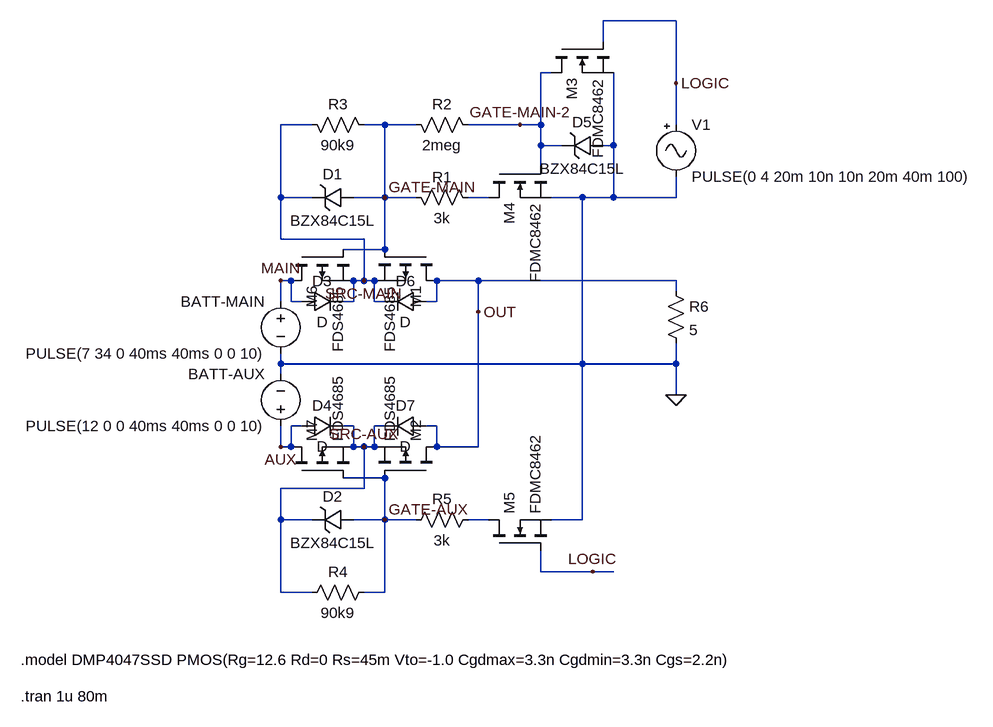
[diagram p0: schematic pmos-switch.asc]
pmos-switch.asc, the LTspice schematic file:
Version 4
SHEET 1 2144 976
WIRE 896 -80 784 -80
WIRE 784 -48 784 -80
WIRE 704 0 688 0
WIRE 896 16 896 -80
WIRE 336 80 288 80
WIRE 448 80 416 80
WIRE 496 80 448 80
WIRE 656 80 576 80
WIRE 688 80 688 0
WIRE 688 80 656 80
WIRE 896 80 896 16
WIRE 688 112 688 80
WIRE 720 112 688 112
WIRE 800 112 800 0
WIRE 800 112 784 112
WIRE 688 144 688 112
WIRE 288 192 288 80
WIRE 336 192 288 192
WIRE 448 192 448 80
WIRE 448 192 400 192
WIRE 496 192 448 192
WIRE 608 192 576 192
WIRE 752 192 704 192
WIRE 800 192 800 112
WIRE 800 192 752 192
WIRE 896 192 896 160
WIRE 896 192 800 192
WIRE 288 256 288 192
WIRE 416 256 288 256
WIRE 448 272 448 192
WIRE 448 272 384 272
WIRE 304 320 288 320
WIRE 416 320 416 256
WIRE 416 320 400 320
WIRE 432 320 416 320
WIRE 592 320 528 320
WIRE 896 320 592 320
WIRE 896 336 896 320
WIRE 288 352 288 320
WIRE 304 352 304 320
WIRE 320 352 304 352
WIRE 400 352 400 320
WIRE 400 352 384 352
WIRE 432 352 432 320
WIRE 448 352 432 352
WIRE 528 352 528 320
WIRE 528 352 512 352
WIRE 592 368 592 320
WIRE 288 448 288 432
WIRE 752 448 752 192
WIRE 752 448 288 448
WIRE 896 448 896 416
WIRE 896 448 752 448
WIRE 288 464 288 448
WIRE 896 496 896 448
WIRE 320 544 304 544
WIRE 400 544 384 544
WIRE 448 544 432 544
WIRE 528 544 512 544
WIRE 288 576 288 544
WIRE 304 576 304 544
WIRE 304 576 288 576
WIRE 400 576 400 544
WIRE 416 576 400 576
WIRE 432 576 432 544
WIRE 432 576 416 576
WIRE 528 576 528 544
WIRE 592 576 592 368
WIRE 592 576 528 576
WIRE 448 624 384 624
WIRE 416 640 416 576
WIRE 416 640 288 640
WIRE 288 688 288 640
WIRE 336 688 288 688
WIRE 448 688 448 624
WIRE 448 688 400 688
WIRE 496 688 448 688
WIRE 608 688 576 688
WIRE 752 688 752 448
WIRE 752 688 704 688
WIRE 688 768 688 736
WIRE 768 768 688 768
WIRE 800 768 768 768
WIRE 288 800 288 688
WIRE 336 800 288 800
WIRE 448 800 448 688
WIRE 448 800 416 800
FLAG 896 496 0
FLAG 448 192 GATE-MAIN
FLAG 592 368 OUT
FLAG 448 688 GATE-AUX
FLAG 288 320 MAIN
FLAG 288 576 AUX
FLAG 896 16 LOGIC
FLAG 768 768 LOGIC
FLAG 656 80 GATE-MAIN-2
FLAG 416 320 SRC-MAIN
FLAG 416 576 SRC-AUX
SYMBOL voltage 288 336 M0
SYMATTR InstName BATT-MAIN
SYMATTR Value PULSE(7 34 0 40ms 40ms 0 0 10)
SYMBOL res 320 64 M90
WINDOW 0 0 56 VBottom 2
WINDOW 3 32 56 VTop 2
SYMATTR InstName R3
SYMATTR Value 90k9
SYMBOL pmos 528 624 M270
SYMATTR InstName M2
SYMATTR Value FDS4685
SYMBOL res 432 784 R90
WINDOW 0 0 56 VBottom 2
WINDOW 3 32 56 VTop 2
SYMATTR InstName R4
SYMATTR Value 90k9
SYMBOL res 480 704 R270
WINDOW 0 32 56 VTop 2
WINDOW 3 0 56 VBottom 2
SYMATTR InstName R5
SYMATTR Value 3k
SYMBOL voltage 288 560 R180
WINDOW 0 24 96 Left 2
WINDOW 3 24 16 Left 2
SYMATTR InstName BATT-AUX
SYMATTR Value PULSE(12 0 0 40ms 40ms 0 0 10)
SYMBOL res 480 64 M90
WINDOW 0 0 56 VBottom 2
WINDOW 3 32 56 VTop 2
SYMATTR InstName R2
SYMATTR Value 2meg
SYMBOL Misc/signal 896 64 R0
SYMATTR InstName V1
SYMATTR Value PULSE(0 4 20m 10n 10n 20m 40m 100)
SYMBOL zener 784 96 R90
WINDOW 0 -4 32 VBottom 2
WINDOW 3 36 32 VTop 2
SYMATTR InstName D5
SYMATTR Value BZX84C15L
SYMBOL res 480 176 M90
WINDOW 0 0 56 VBottom 2
WINDOW 3 32 56 VTop 2
SYMATTR InstName R1
SYMATTR Value 3k
SYMBOL pmos 528 272 R90
SYMATTR InstName M1
SYMATTR Value FDS4685
SYMBOL nmos 704 -48 M90
SYMATTR InstName M3
SYMATTR Value FDMC8462
SYMBOL nmos 608 736 R270
SYMATTR InstName M5
SYMATTR Value FDMC8462
SYMBOL zener 400 176 R90
WINDOW 0 -4 32 VBottom 2
WINDOW 3 36 32 VTop 2
SYMATTR InstName D1
SYMATTR Value BZX84C15L
SYMBOL zener 400 672 R90
WINDOW 0 -4 32 VBottom 2
WINDOW 3 36 32 VTop 2
SYMATTR InstName D2
SYMATTR Value BZX84C15L
SYMBOL nmos 608 144 M90
SYMATTR InstName M4
SYMATTR Value FDMC8462
SYMBOL res 880 320 R0
SYMATTR InstName R6
SYMATTR Value 5
SYMBOL diode 512 336 R90
WINDOW 0 0 32 VBottom 2
WINDOW 3 32 32 VTop 2
SYMATTR InstName D6
SYMBOL diode 512 528 R90
WINDOW 0 0 32 VBottom 2
WINDOW 3 32 32 VTop 2
SYMATTR InstName D7
SYMBOL pmos 304 272 M90
SYMATTR InstName M6
SYMATTR Value FDS4685
SYMBOL diode 320 336 M90
WINDOW 0 0 32 VBottom 2
WINDOW 3 32 32 VTop 2
SYMATTR InstName D3
SYMBOL pmos 304 624 R270
SYMATTR InstName M7
SYMATTR Value FDS4685
SYMBOL diode 320 528 M90
WINDOW 0 0 32 VBottom 2
WINDOW 3 32 32 VTop 2
SYMATTR InstName D4
TEXT -112 960 Left 2 !.tran 1u 80m
TEXT -112 904 Left 2 !.model DMP4047SSD PMOS(Rg=12.6 Rd=0 Rs=45m Vto=-1.0 Cgdmax=3.3n Cgdmin=3.3n Cgs=2.2n)

The netlist it stands for:
* pmos-switch.asc
V§BATT-MAIN MAIN 0 PULSE(7 34 0 40ms 40ms 0 0 10)
R3 SRC-MAIN GATE-MAIN 90k9
M2 OUT GATE-AUX SRC-AUX SRC-AUX FDS4685
R4 GATE-AUX SRC-AUX 90k9
R5 GATE-AUX N002 3k
V§BATT-AUX AUX 0 PULSE(12 0 0 40ms 40ms 0 0 10)
R2 GATE-MAIN GATE-MAIN-2 2meg
V1 LOGIC 0 PULSE(0 4 20m 10n 10n 20m 40m 100)
D5 0 GATE-MAIN-2 BZX84C15L
R1 GATE-MAIN N001 3k
M1 OUT GATE-MAIN SRC-MAIN SRC-MAIN FDS4685
M3 GATE-MAIN-2 LOGIC 0 0 FDMC8462
M5 N002 LOGIC 0 0 FDMC8462
D1 GATE-MAIN SRC-MAIN BZX84C15L
D2 GATE-AUX SRC-AUX BZX84C15L
M4 N001 GATE-MAIN-2 0 0 FDMC8462
R6 OUT 0 5
D6 OUT SRC-MAIN D
D7 OUT SRC-AUX D
M6 MAIN GATE-MAIN SRC-MAIN SRC-MAIN FDS4685
D3 MAIN SRC-MAIN D
M7 AUX GATE-AUX SRC-AUX SRC-AUX FDS4685
D4 AUX SRC-AUX D
.model D D
.lib standard.dio
.model NMOS NMOS
.model PMOS PMOS
.lib standard.mos
.tran 1u 80m
.model DMP4047SSD PMOS(Rg=12.6 Rd=0 Rs=45m Vto=-1.0 Cgdmax=3.3n Cgdmin=3.3n Cgs=2.2n)
.backanno
.end